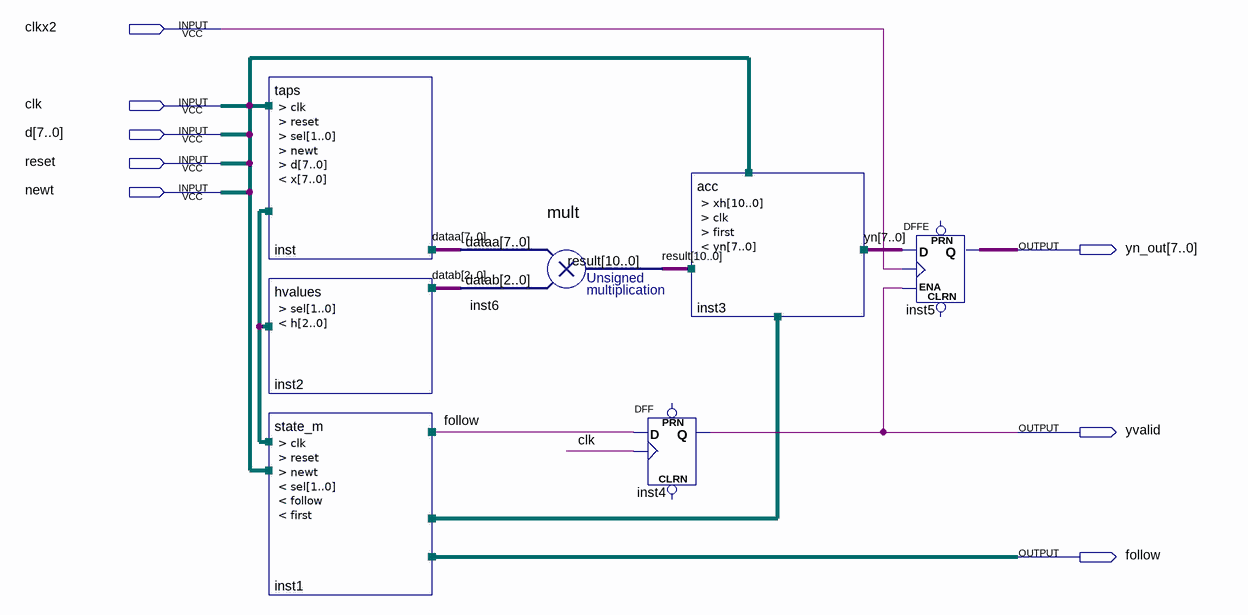
[diagram p0: schematic sheet]
// Quartus schematic filtref.bdf as structural Verilog: 7 symbols, 8 pins
module filtref (
  input  clkx2,
  input  clk,
  input  [7:0] d,
  input  reset,
  input  newt,
  output [7:0] yn_out,
  output yvalid,
  output follow
);

  wire first;
  wire [1:0] sel;
  wire [2:0] datab;
  wire [7:0] dataa, yn;
  wire [10:0] result;

  taps inst (.clk(clk), .reset(reset), .sel(sel), .newt(newt), .d(d), .x(dataa));
  hvalues inst2 (.sel(sel), .h(datab));
  state_m inst1 (.clk(clk), .reset(reset), .newt(newt), .sel(sel), .follow(follow), .first(first));
  mult inst6 (.dataa(dataa), .datab(datab), .result(result));
  DFF inst4 (.CLK(clk), .D(follow), .Q(yvalid));  // open: CLRN, PRN
  acc inst3 (.xh(result), .clk(clk), .first(first), .yn(yn));
  DFFE inst5[7:0] (.D(yn), .CLK(clkx2), .ENA(yvalid), .Q(yn_out));  // open: PRN, CLRN
endmodule
